# EAGLE design display (EAGLE 6.5.0)
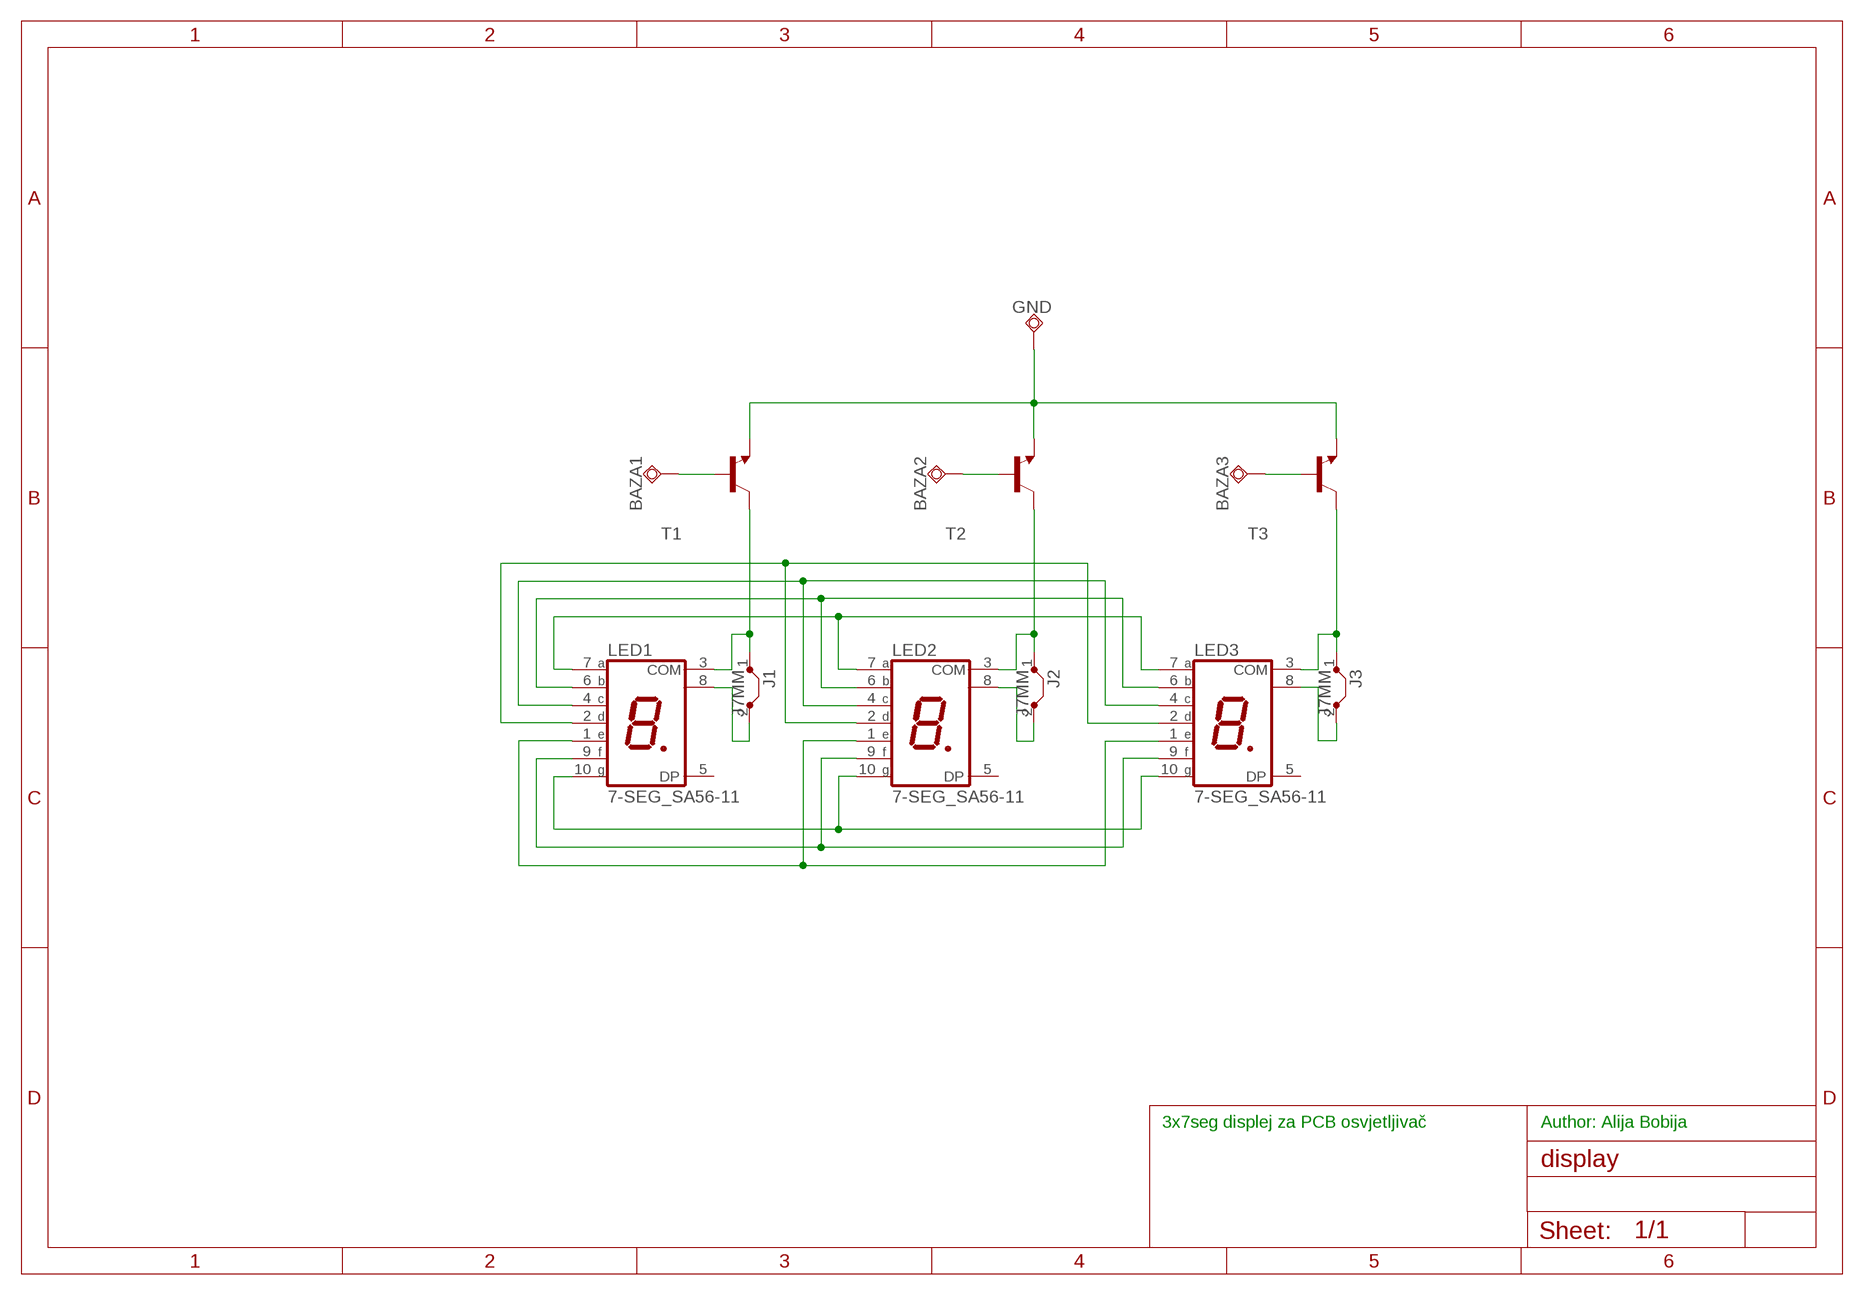
[diagram p0: schematic, sheet 1]

## Parts
BAZA1  TPSQTP20SQ  [TP20SQ]
BAZA2  TPSQTP20SQ  [TP20SQ]
BAZA3  TPSQTP20SQ  [TP20SQ]
GND  TPSQTP20SQ  [TP20SQ]
J1  J7MM  [07]
J2  J7MM  [07]
J3  J7MM  [07]
LED1  7-SEG_SA56-11  [SA56-11]
LED2  7-SEG_SA56-11  [SA56-11]
LED3  7-SEG_SA56-11  [SA56-11]
T1  -NPN-SOT23-EBC  [SOT23-EBC]
T2  -NPN-SOT23-EBC  [SOT23-EBC]
T3  -NPN-SOT23-EBC  [SOT23-EBC]

## Nets
N$1: LED1.7(A) LED2.7(A) LED3.7(A)
N$2: LED1.10(G) LED2.10(G) LED3.10(G)
N$3: LED1.6(B) LED2.6(B) LED3.6(B)
N$4: LED1.9(F) LED2.9(F) LED3.9(F)
N$5: LED1.4(C) LED2.4(C) LED3.4(C)
N$6: LED1.1(E) LED2.1(E) LED3.1(E)
N$7: LED1.2(D) LED2.2(D) LED3.2(D)
N$8: J1.1 LED1.3(COM) T1.C
N$9: J1.2 LED1.8(COM)
N$10: J2.1 LED2.3(COM) T2.C
N$11: J2.2 LED2.8(COM)
N$12: J3.1 LED3.3(COM) T3.C
N$13: J3.2 LED3.8(COM)
N$14: BAZA1.TP T1.B
N$15: BAZA2.TP T2.B
N$16: BAZA3.TP T3.B
N$17: GND.TP T1.E T2.E T3.E
Unconnected: LED1.5(DP) LED2.5(DP) LED3.5(DP)

## Notes on the sheet
- 3x7seg displej za PCB osvjetljivač | Author: Alija Bobija

## Library data of the parts
BAZA1-BAZA3 GND = testpad:TPSQ: Test pad
J1-J3 = jumper:J: Bridge
LED1-LED3 = display-kingbright:7-SEG_: Kingbright 14.2mm (0.56 INCH) SINGLE DIGIT NUMERIC DUISPLAY Source: SA56-11EWA(Ver1189471036.pdf; OC_FARNELL: unknown; OC_NEWARK: unknown
T1-T3 = transistor:*-NPN-: NPN Transistror BF959 corrected 2008.03.06

## Board
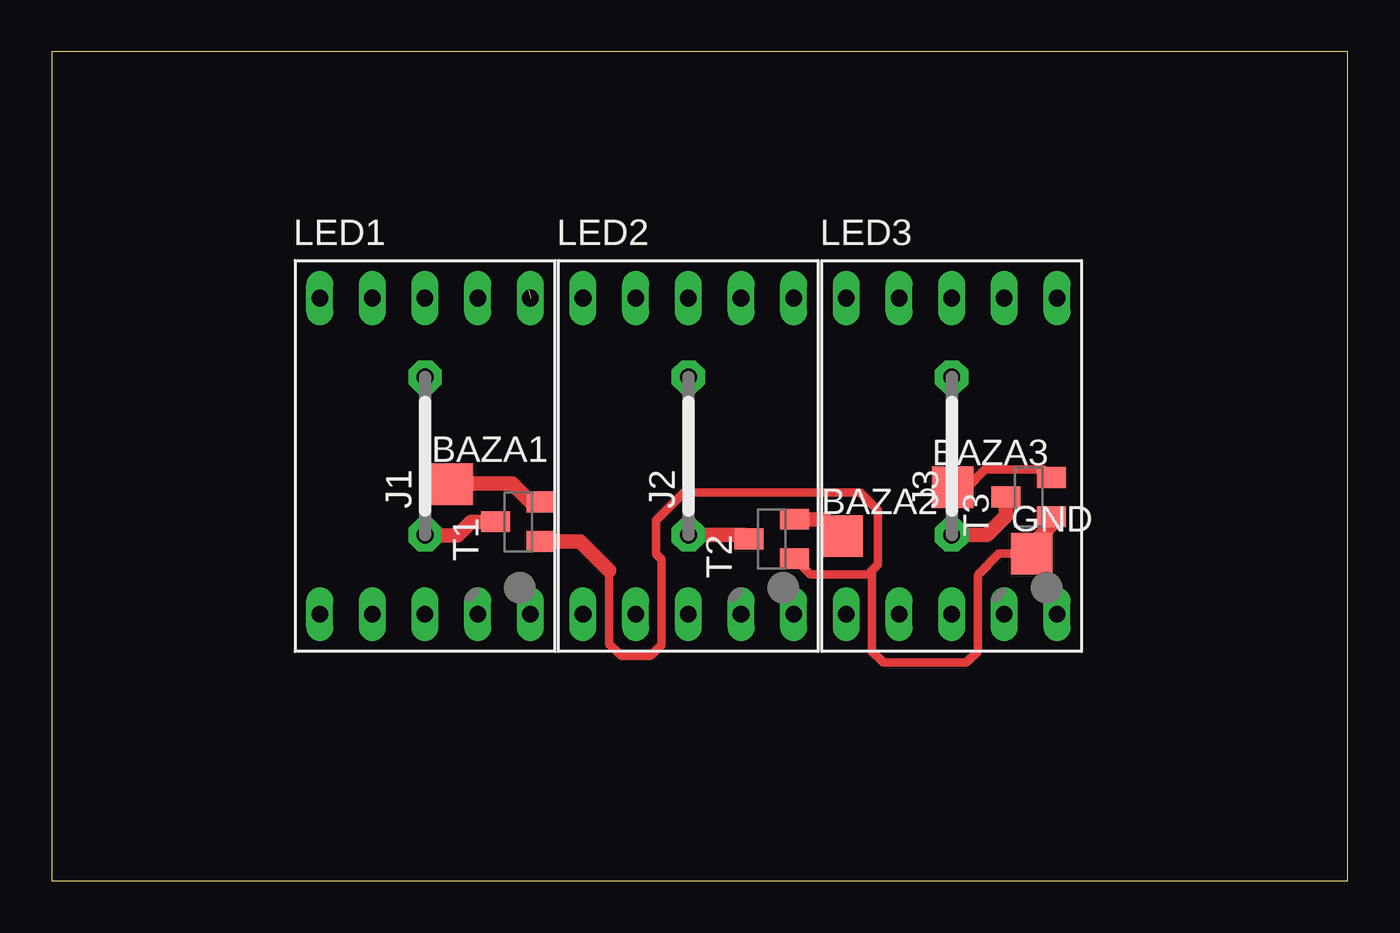
[diagram p1: board, top side]
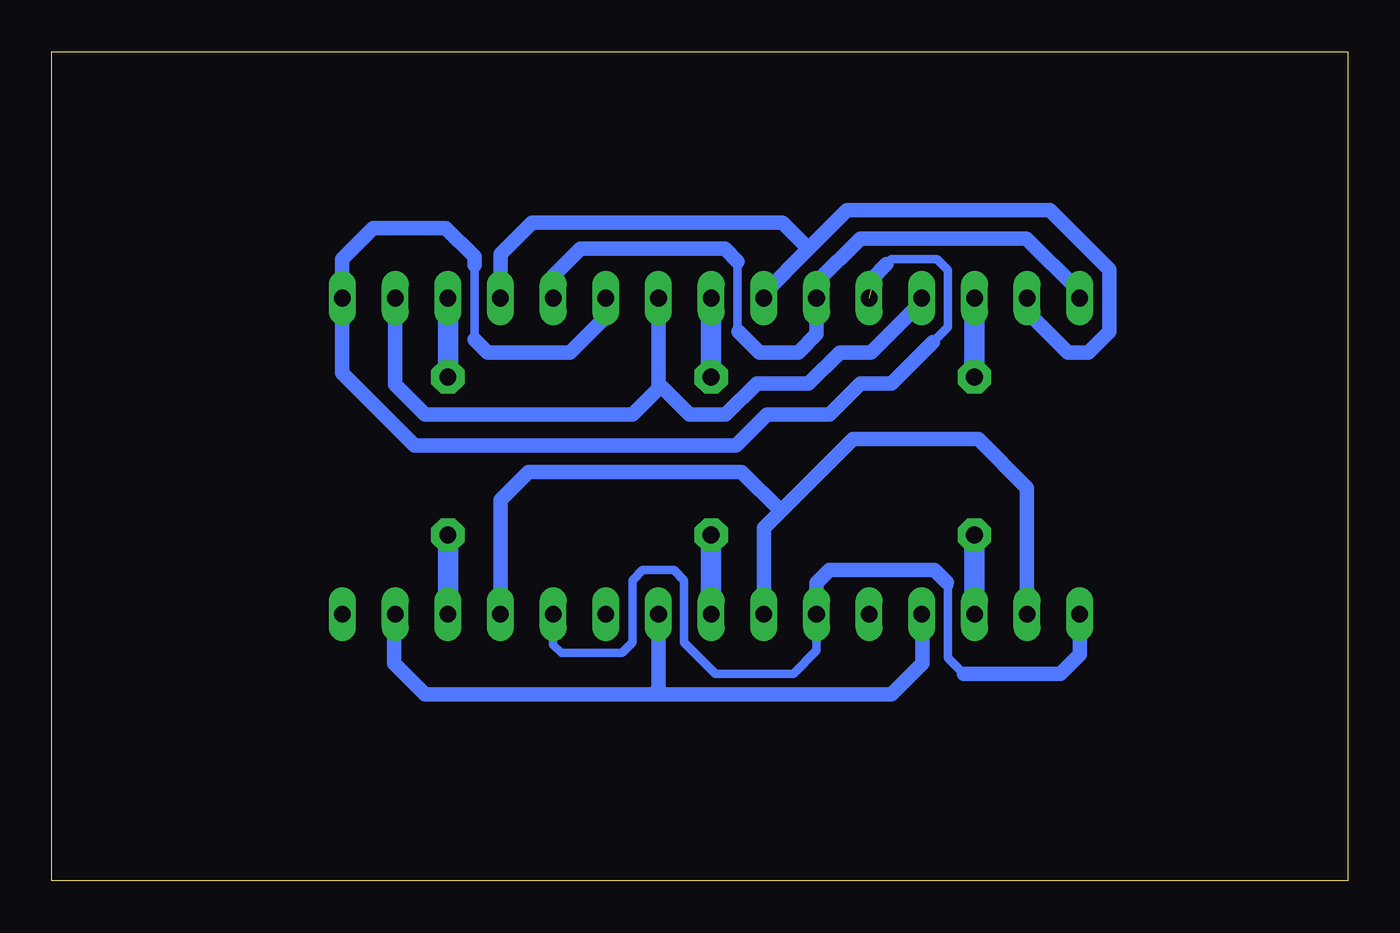
[diagram p2: board, bottom side, seen from below]

Size 62.5 x 40 mm. Coordinates in mm from the lower left corner, seen from the top.
Outline: 0,0 62.5,0 62.5,40 0,40 0,0
Copper layers (1*16): Top 0.035mm / dielectric 1.5mm / Bottom 0.035mm
Design rules "default": minimum track width 10mil, minimum drill 24mil, track to track 8mil, track to pad 8mil, pad to pad 8mil, via to via 8mil, smd to smd 8mil, copper to edge 40mil, drill to drill 8mil, minimum pad ring 10mil, minimum via ring 8mil, stop-mask expansion 4mil, vias tented up to drill 0mil, thermal gap 10mil

### Footprints (pad centres in the part's own frame; a part is rotated, then mirrored left to right if it is on the bottom)
TP20SQ = smd 2 x 2: TP 0,0
07 = drill 0.813 pad 1.6 octagon: 1 -3.81,0; 2 3.81,0
SA56-11 = drill 0.8 long: 1 -5.08,-7.62; 2 -2.54,-7.62; 3 0,-7.62; 4 2.54,-7.62; 5 5.08,-7.62; 6 5.08,7.62; 7 2.54,7.62; 8 0,7.62; 9 -2.54,7.62; 10 -5.08,7.62
SOT23-EBC = smd 1 x 1.4: B 0.95,-1.1; C 0,1.1; E -0.95,-1.1

### Placement (x,y rotation side)
BAZA1  19.31,19.15 0 top
BAZA2  38.11,16.63 0 top
BAZA3  43.45,18.99 0 top
GND  47.25,15.79 0 top
J1  18,20.5 90 top
J2  30.7,20.5 90 top
J3  43.4,20.5 90 top
LED1  18,20.5 0 top
LED2  30.7,20.5 0 top
LED3  43.4,20.5 0 top
T1  22.5,17.33 90 top
T2  34.72,16.5 90 top
T3  47.11,18.52 90 top

### Tracks (layer width: path | path; a pad name or v marks a point on that pad's centre or on a via)
N$1
  Bottom 0.7: LED1.7 20.54,27.96 23,25.5 24.5,25.5 26,24 28.5,24 30,22.5 31.74,22.5 33.12,23.88 | 33.12,23.88 33.24,24 LED2.7 | LED3.7 45.94,23.94 44.5,22.5 34.5,22.5 33.12,23.88
N$2
  Bottom 0.4: 29.42,29.89 29.42,26.57 29.38,26.51
  Bottom 0.7: 29.38,26.51 28.37,25.5 26.5,25.5 25.62,26.38 LED2.10 25.62,28.88 23.5,31 15.5,31 13,28.5 13,28.2 LED1.10 | LED3.10 38.32,29.18 37,30.5 30.03,30.5 29.42,29.89
N$3  (1 unrouted)
  Bottom 0.4: 42.12,26.13 42.12,29.69 42.11,29.7 | 22.25,29.75 22,30 19.8,30 19.27,29.47 19.27,26.73 20,26
  Bottom 0.7: LED2.6 35.78,27.22 37.5,25.5 41.49,25.5 42.12,26.13 | 23,28.5 23,29 22.25,29.75 | 20,26 22,24 23.5,24 25,22.5 28,22.5 29.5,21 45,21 48.5,24.5 48.5,28.1 LED3.6 48.5,28.14 48.5,30 47,31.5 43.5,31.5 42.11,30.11 42.11,29.7
N$4
  Bottom 0.7: LED2.9 28.16,28.34 26,30.5 | 26,30.5 24.14,32.36 14.36,32.36 11.5,29.5 11.5,26.5 12.5,25.5 13.5,25.5 15.5,27.5 15.5,28.08 LED1.9 | LED3.9 40.86,30.23 39.34,31.75 27.25,31.75 26,30.5
N$5
  Bottom 0.7: LED3.4 46,12.82 46,10.5 44.5,9 33.5,9 | 33.5,9 22,9 20.5,10.5 20.5,12.84 LED1.4 | LED2.4 33.24,9.26 33.5,9
N$6
  Bottom 0.4: LED3.1 38.32,11.4 37.92,11 35,11 34.5,11.5 34.5,14.5 34,15 32.5,15 32,14.5 32,11.5 30.5,10 26.73,10 25.61,11.12 LED2.1 | 19.33,14.4 19.33,14.29 19.24,14.2 19.24,14.21 19.25,14.21 19.27,14.19 19.27,10.77 18.5,10
  Bottom 0.7: 25.62,11.88 LED2.1 25.62,14.38 25,15 19.93,15 19.33,14.4 | 18.5,10 13.86,10 12.92,10.94 LED1.1
N$7
  Bottom 0.7: LED1.2 15.46,18.96 17.82,21.32 23.86,21.32 27.34,17.84 | 27.34,17.84 28.16,17.02 LED2.2 | LED3.2 40.86,18.38 39.5,19.74 29.24,19.74 27.34,17.84
N$8
  Top 0.7: T1.C 20.22,17.33 19.57,16.68 J1.1
  Bottom 1: J1.1 LED1.3
N$9
  Bottom 1: J1.2 LED1.8
N$10
  Top 0.7: J2.1 33.43,16.69 T2.C
  Bottom 1: J2.1 LED2.3
N$11
  Bottom 1: J2.2 LED2.8
N$12
  Top 0.7: J3.1 45.1,16.69 46.01,17.6 T3.C
  Bottom 1: J3.1 LED3.3
N$13
  Bottom 1: J3.2 LED3.8
N$14
  Top 0.7: T1.B 23.08,18.28 22.19,19.17 19.33,19.17 BAZA1.TP
N$15
  Top 0.7: T2.B 37.29,17.45 BAZA2.TP
N$16
  Top 0.4: 43.99,18.99 44.15,18.99 45.01,19.85 47.83,19.85 T3.B
  Top 0.5: BAZA3.TP 43.99,18.99
N$17
  Top 0.4: 26.88,14.98 26.88,11.45 27.48,10.85 28.87,10.85 29.4,11.38 29.4,15.51 29.14,15.77 29.14,17.4 30.48,18.74 38.98,18.74 39.84,17.88 39.84,15.27 39.56,14.99 | 39.56,14.99 39.35,14.78 36.59,14.78 T2.E | GND.TP 45.69,15.79 44.7,14.8 44.7,14.79 44.66,14.75 44.66,11.08 44.12,10.54 40.1,10.54 39.54,11.1 39.54,11.09 39.56,11.07 39.56,14.99
  Top 0.7: GND.TP 47.25,16.21 48.21,17.17 T3.E | T1.E 25.48,16.38 26.88,14.98